# EAGLE design squawkbox_m_rj11_0.1.0 (EAGLE 7.6.0)
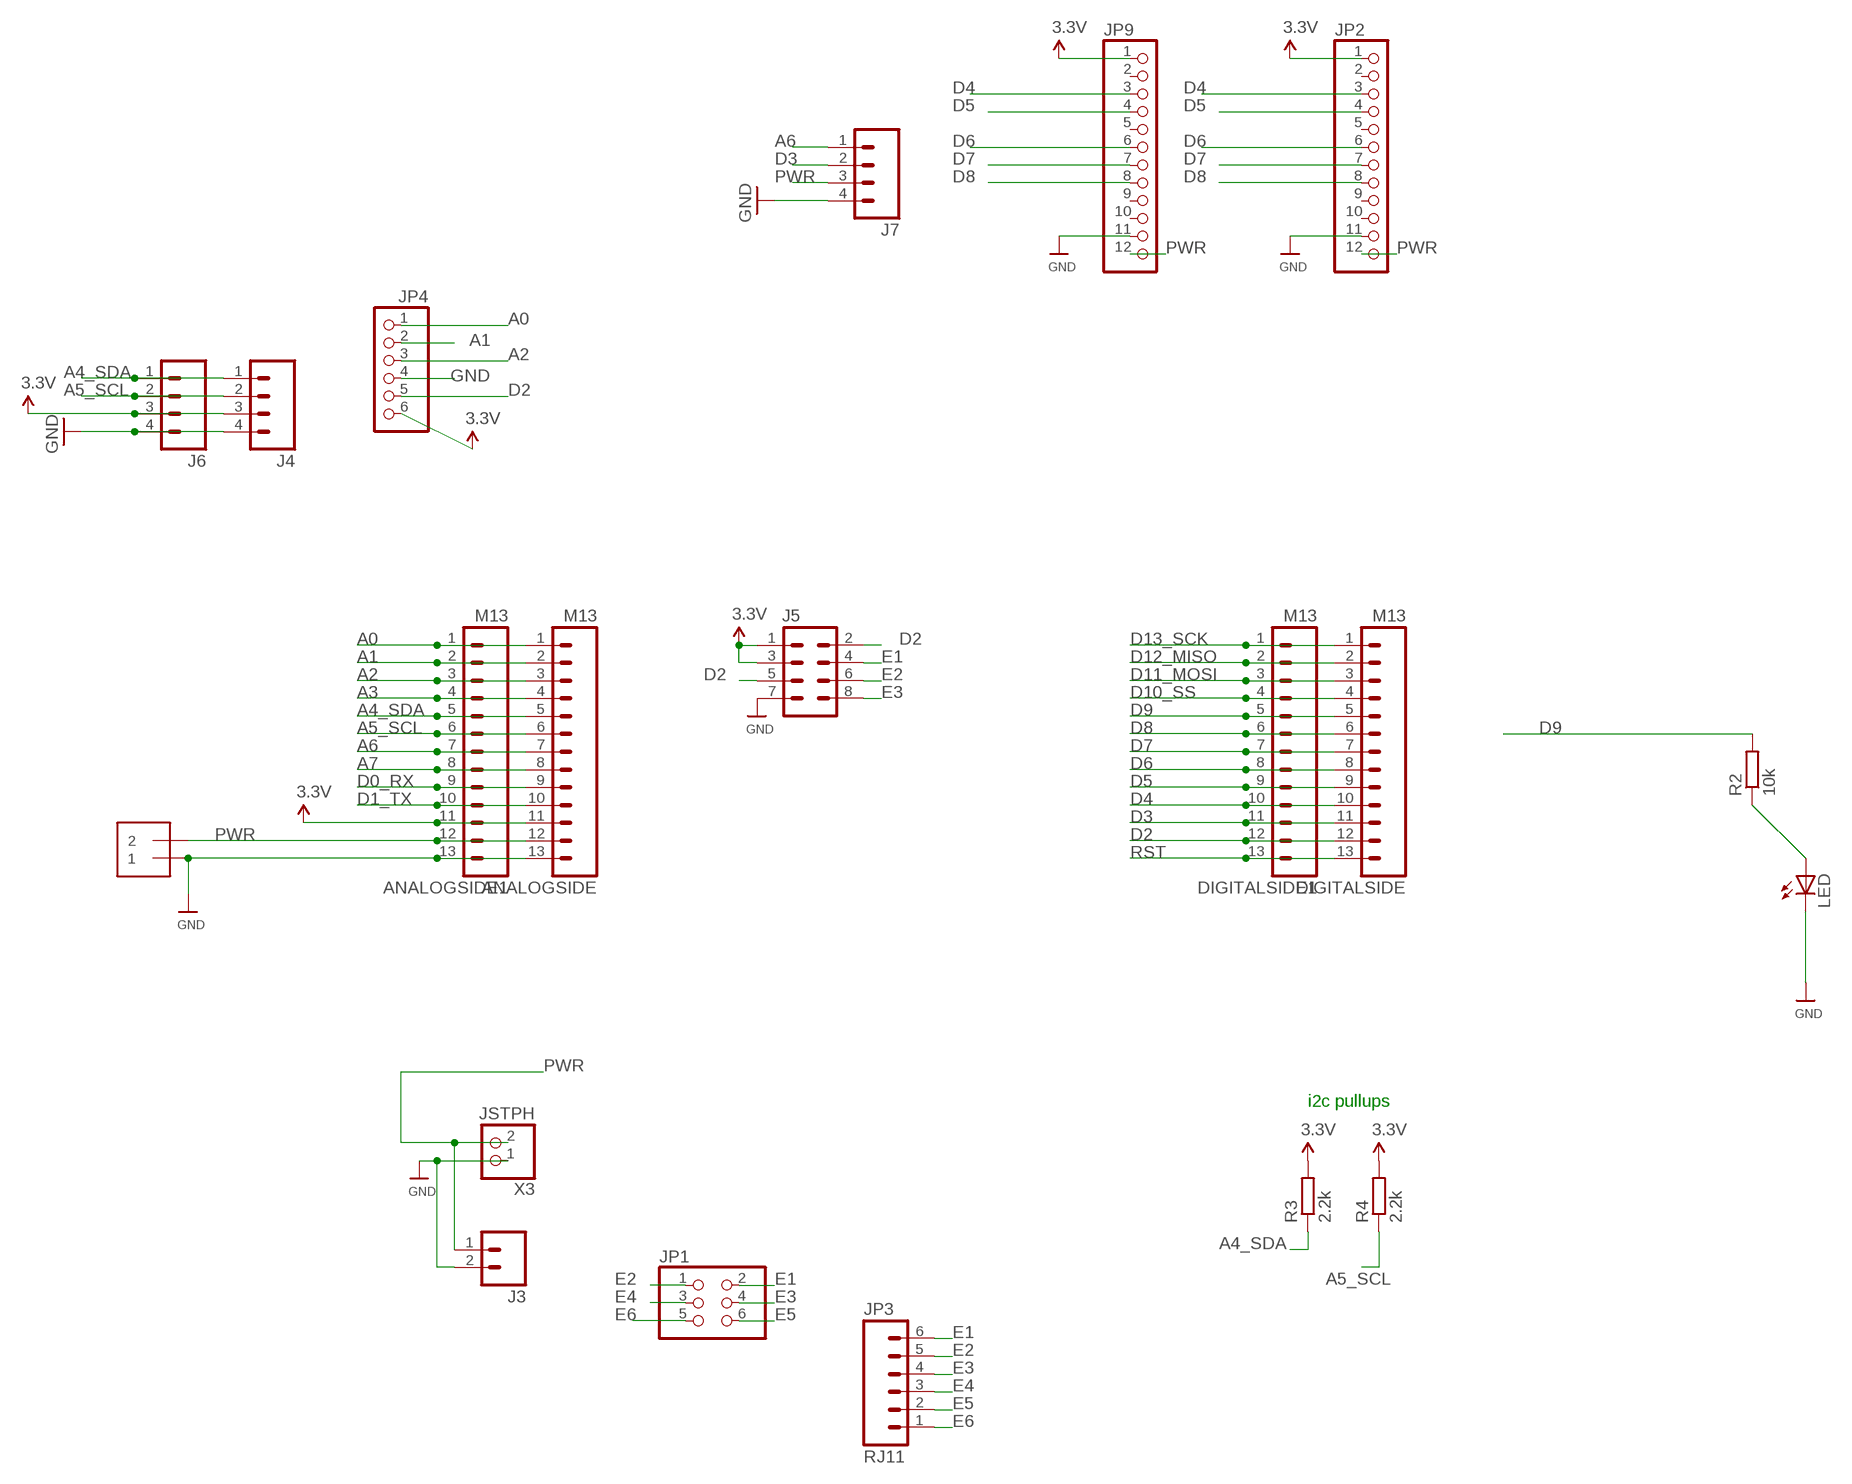
[diagram p0: schematic, sheet 1]

## Parts
ANALOGSIDE  M13  [1X13]
ANALOGSIDE1  M13  [1X13]
DIGITALSIDE  M13  [1X13]
DIGITALSIDE1  M13  [1X13]
J2  1X2-3.5MM  [1X2-3.5MM]
J3  M02PTH  [1X02]
J4  M04PTH  [1X04]
J5  M04X2  [2X4]
J6  M04SCREW  [SCREWTERMINAL-3.5MM-4]
J7  M04SCREW  [SCREWTERMINAL-3.5MM-4]
JP1  PINHD-2X3  [2X03]
JP2  PINHD-1X12-CB  [1X12-CB]
JP3  RJ11  RJ11-6PTH  [RJ11-6]
JP4  PINHD-1X6-3.5MM  [1X06-3.5MM]
JP9  PINHD-1X12-CB  [1X12-CB]
LED  LED3MM  [LED3MM]
R2  10k  R-EU_0204/7  [0204/7]
R3  2.2k  R-EU_0204/7  [0204/7]
R4  2.2k  R-EU_0204/7  [0204/7]
X3  JSTPH  CON_JST_PH_2PIN  [JSTPH2]

## Nets
A0: ANALOGSIDE1.1 ANALOGSIDE.1 JP4.1
A1: ANALOGSIDE1.2 ANALOGSIDE.2 JP4.2
A2: ANALOGSIDE1.3 ANALOGSIDE.3 JP4.3
A3: ANALOGSIDE1.4 ANALOGSIDE.4
A4_SDA: ANALOGSIDE1.5 ANALOGSIDE.5 J4.1 J6.1 R3.1
A5_SCL: ANALOGSIDE1.6 ANALOGSIDE.6 J4.2 J6.2 R4.1
A6: ANALOGSIDE1.7 ANALOGSIDE.7 J7.1
A7: ANALOGSIDE1.8 ANALOGSIDE.8
D0_RX: ANALOGSIDE1.9 ANALOGSIDE.9
D1_TX: ANALOGSIDE1.10 ANALOGSIDE.10
D2: DIGITALSIDE1.12 DIGITALSIDE.12 J5.2 J5.5 JP4.5
D3: DIGITALSIDE1.11 DIGITALSIDE.11 J7.2
D4: DIGITALSIDE1.10 DIGITALSIDE.10 JP2.3 JP9.3
D5: DIGITALSIDE1.9 DIGITALSIDE.9 JP2.4 JP9.4
D6: DIGITALSIDE1.8 DIGITALSIDE.8 JP2.6 JP9.6
D7: DIGITALSIDE1.7 DIGITALSIDE.7 JP2.7 JP9.7
D8: DIGITALSIDE1.6 DIGITALSIDE.6 JP2.8 JP9.8
D9: DIGITALSIDE1.5 DIGITALSIDE.5 R2.2
D10_SS: DIGITALSIDE1.4 DIGITALSIDE.4
D11_MOSI: DIGITALSIDE1.3 DIGITALSIDE.3
D12_MISO: DIGITALSIDE1.2 DIGITALSIDE.2
D13_SCK: DIGITALSIDE1.1 DIGITALSIDE.1
E1: J5.4 JP1.2 JP3.6
E2: J5.6 JP1.1 JP3.5
E3: J5.8 JP1.4 JP3.4
E4: JP1.3 JP3.3
E5: JP1.6 JP3.2
E6: JP1.5 JP3.1
GND [power]: ANALOGSIDE1.13 ANALOGSIDE.13 J2.1 J3.2 J4.4 J5.7 J6.4 J7.4 JP2.11 JP4.4 JP9.11 LED.K(C) X3.1
N$2: LED.A R2.1
PWR [power]: ANALOGSIDE1.12 ANALOGSIDE.12 J2.2 J3.1 J7.3 JP2.12 JP9.12 X3.2
RST: DIGITALSIDE1.13 DIGITALSIDE.13
SPEAKER2+: JP2.10
SPEAKER2+1: JP9.10
VCC [power]: ANALOGSIDE1.11 ANALOGSIDE.11 J4.3 J5.1 J5.3 J6.3 JP2.1 JP4.6 JP9.1 R3.2 R4.2 ; supply symbol labelled 3.3V
Unconnected: JP2.2 JP2.5 JP2.9 JP9.2 JP9.5 JP9.9

## Notes on the sheet
- i2c pullups

## Library data of the parts
ANALOGSIDE ANALOGSIDE1 DIGITALSIDE DIGITALSIDE1 = SparkFun-Connectors:M13: 13-pin single row .1" header
J2 = adafruit:1X2: 3.5mm Terminal block http://www.ladyada.net/library/pcb/eaglelibrary.html
J3 = SparkFun-Connectors:M02: Standard 2-pin 0.1" header. Use with - straight break away headers ( PRT-00116) - right angle break away headers (PRT-00553) - swiss pins (PRT-00743) - machine pins (PRT-00117) - female headers (PRT-00115) Molex polarized connector foot print use with: PRT-08233 with associated crimp pins and housings. 2.54_SCREWTERM for use with PRT-10571. 3.5mm Screw Terminal footprints for PRT-08084 5mm Screw Terminal footprints for use with PRT-08432
J4 = SparkFun-Connectors:M04: Header 4 Standard 4-pin 0.1" header. Use with straight break away headers (SKU : PRT-00116), right angle break away headers (PRT-00553), swiss pins (PRT-00743), machine pins (PRT-00117), and female headers (PRT-00115). Molex polarized connector foot print use with SKU : PRT-08231 with associated crimp pins and housings. 1MM SMD Version SKU: PRT-10208; PROD_ID: CONN-09696
J5 = SparkFun-Connectors:M04X2: .1" header, two rows of four.
J6 J7 = SparkFun-Connectors:M04: Header 4 Standard 4-pin 0.1" header. Use with straight break away headers (SKU : PRT-00116), right angle break away headers (PRT-00553), swiss pins (PRT-00743), machine pins (PRT-00117), and female headers (PRT-00115). Molex polarized connector foot print use with SKU : PRT-08231 with associated crimp pins and housings. 1MM SMD Version SKU: PRT-10208; PROD_ID: Combine 2x8399
JP1 = pinhead:PINHD-2X3: PIN HEADER
JP2 JP9 = adafruit2:PINHD-1X12: PIN HEADER
JP3 = SparkFun-Connectors:RJ11-6: RJ11 Jack Simple 6 pin RJ11 jack. Commonly found on CAT3 devices and Microchip programmers. SKU: PRT-00132; PROD_ID: CONN-08590
JP4 = adafruit:PINHD-1X6: PIN HEADER
LED = led:LED: LED OSRAM: - CHIPLED LG R971, LG N971, LY N971, LG Q971, LY Q971, LO R971, LY R971 LH N974, LH R974 LS Q976, LO Q976, LY Q976 LO Q996 - Hyper CHIPLED LW Q18S LB Q993, LB Q99A, LB R99A - SideLED LS A670, LO A670, LY A670, LG A670, LP A670 LB A673, LV A673, LT A673, LW A673 LH A674 LY A675 LS A676, LA A676, LO A676, LY A676, LW A676 LS A679, LY A679, LG A679 - Hyper Micro SIDELED® LS Y876, LA Y876, LO Y876, LY Y876 LT Y87S - SmartLED LW L88C, LW L88S LB L89C, LB L89S, LG L890 LS L89K, LO L89K, LY L89K LS L896, LA L896, LO L896, LY L896 - TOPLED LS T670, LO T670, LY T670, LG T670, LP T670 LSG T670, LSP T670, LSY T670, LOP T670, LYG T670 LG T671, LOG T671, LSG T671 LB T673, LV T673, LT T673, LW T673 LH T674 LS T676, LA T676, LO T676, LY T676, LB T676, LH T676, LSB T676, LW T676 LB T67C, LV T67C, LT T67C, LS T67K, LO T67K, LY T67K, LW E67C LS E67B, LA E67B, LO E67B, LY E67B, LB E67C, LV E67C, LT E67C LW T67C LS T679, LY T679, LG T679 LS T770, LO T770, LY T770, LG T770, LP T770 LB T773, LV T773, LT T773, LW T773 LH T774 LS E675, LA E675, LY E675, LS T675 LS T776, LA T776, LO T776, LY T776, LB T776 LHGB T686 LT T68C, LB T68C - Hyper Mini TOPLED® LB M676 - Mini TOPLED Santana® LG M470 LS M47K, LO M47K, LY M47K Source: http://www.osram.convergy.de LUXEON: - LUMILED® LXK2-PW12-R00, LXK2-PW12-S00, LXK2-PW14-U00, LXK2-PW14-V00 LXK2-PM12-R00, LXK2-PM12-S00, LXK2-PM14-U00 LXK2-PE12-Q00, LXK2-PE12-R00, LXK2-PE12-S00, LXK2-PE14-T00, LXK2-PE14-U00 LXK2-PB12-K00, LXK2-PB12-L00, LXK2-PB12-M00, LXK2-PB14-N00, LXK2-PB14-P00, LXK2-PB14-Q00 LXK2-PR12-L00, LXK2-PR12-M00, LXK2-PR14-Q00, LXK2-PR14-R00 LXK2-PD12-Q00, LXK2-PD12-R00, LXK2-PD12-S00 LXK2-PH12-R00, LXK2-PH12-S00 LXK2-PL12-P00, LXK2-PL12-Q00, LXK2-PL12-R00 Source: www.luxeon.com KINGBRIGHT: KA-3528ASYC Source: www.kingbright.com
R2-R4 = resistor:R-EU_: RESISTOR, European symbol
X3 = microbuilder:CON_JST_PH_2PIN: JST 2-Pin Right-Angle Connector PH-Series - 4UConnector: 17311 SH-Series - 4UConnector: 07278

## Net classes
1 power: width 0.381 mm, clearance 0.254 mm

## Board
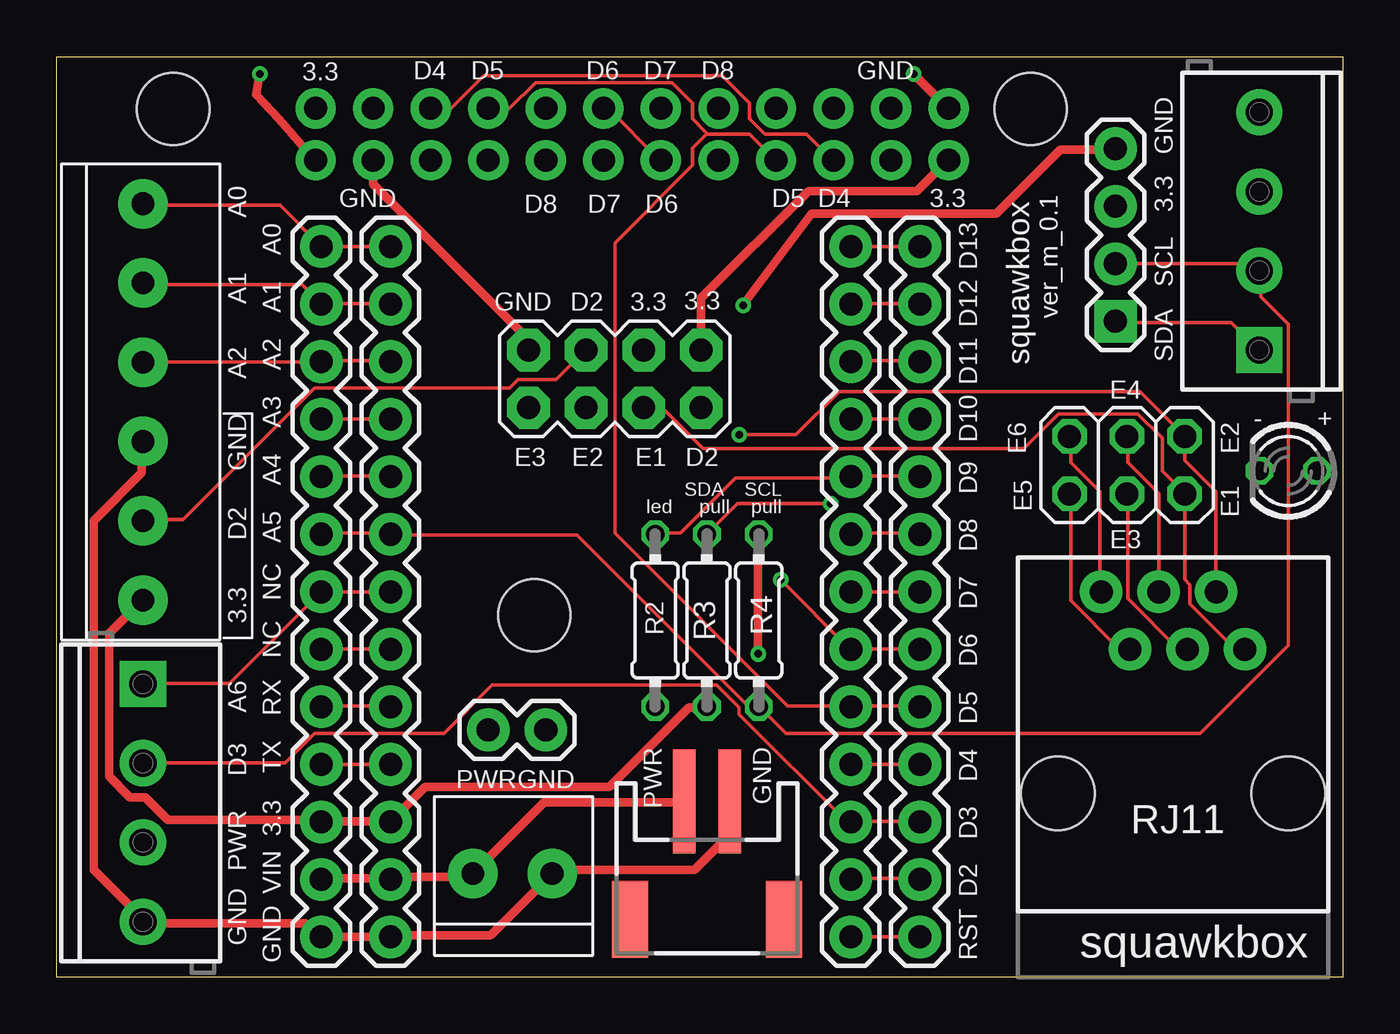
[diagram p1: board, top side]
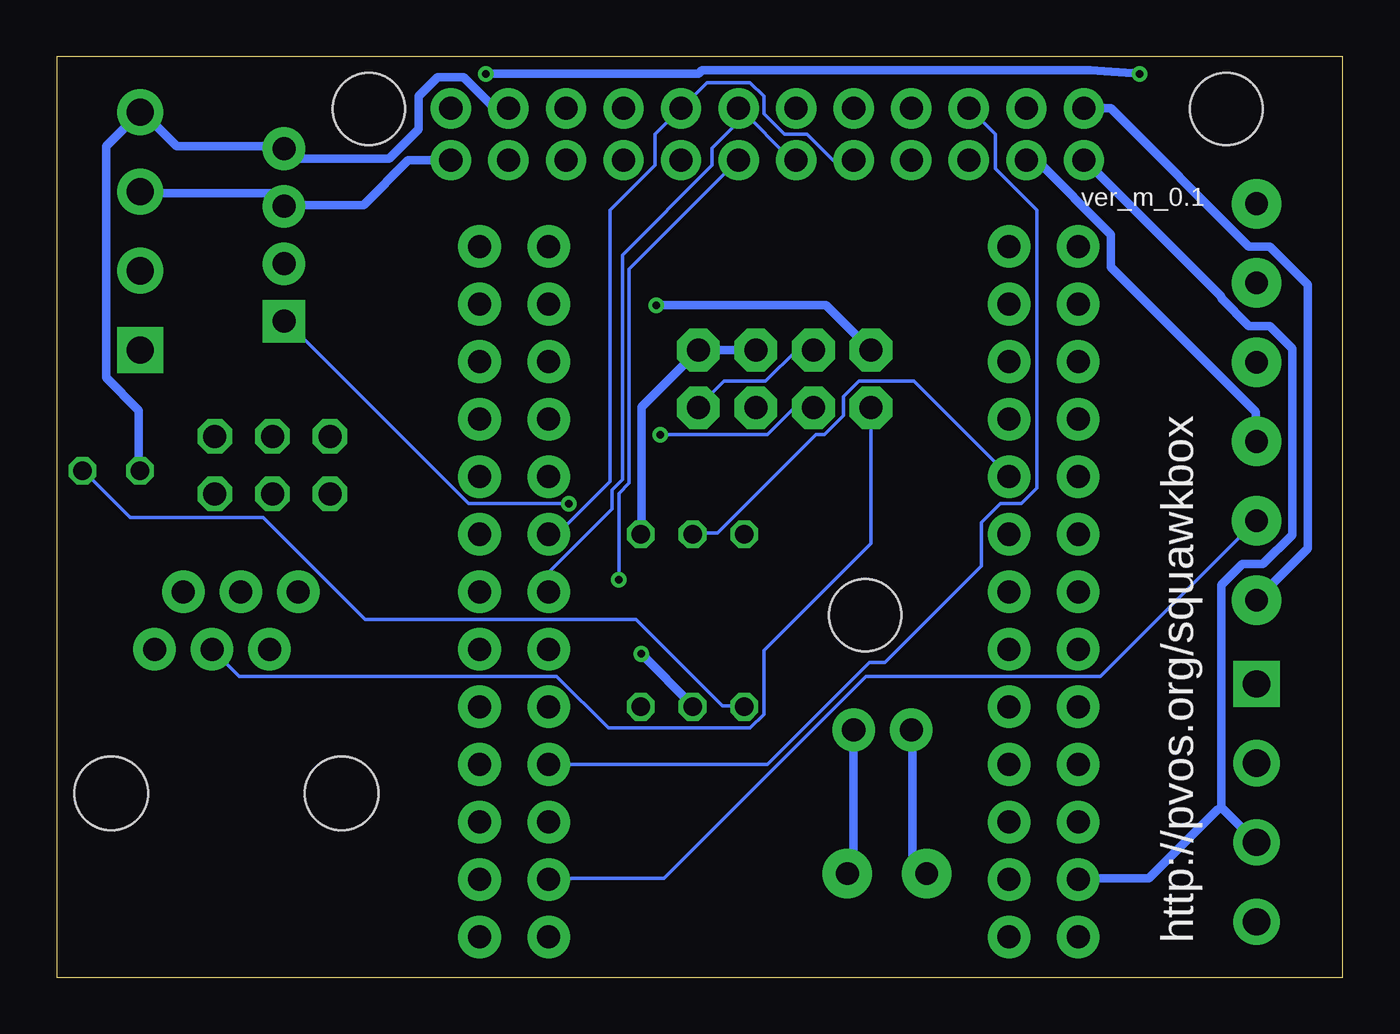
[diagram p2: board, bottom side, seen from below]

Size 56.77 x 40.64 mm. Coordinates in mm from the lower left corner, seen from the top.
Outline: 0,40.64 56.77,40.64 56.77,0 0,0 0,40.64
Copper layers (1*16): Top 0.0356mm / dielectric 1.5011mm / Bottom 0.0356mm
Design rules "oshpark-2layer": minimum track width 6mil, minimum drill 13mil, track to track 6mil, track to pad 6mil, pad to pad 6mil, via to via 6mil, smd to smd 6mil, copper to edge 15mil, drill to drill 6mil, minimum pad ring 7mil, minimum via ring 7mil, stop-mask expansion 2.5mil, vias tented up to drill 0mil, thermal gap 10mil
Holes 3.2 mm at 5.14,38.33 42.99,38.33 21.08,15.98

### Footprints (pad centres in the part's own frame; a part is rotated, then mirrored left to right if it is on the bottom)
1X13 = drill 1.016 pad 1.88: 1 0,0; 2 2.54,0; 3 5.08,0; 4 7.62,0; 5 10.16,0; 6 12.7,0; 7 15.24,0; 8 17.78,0; 9 20.32,0; 10 22.86,0; 11 25.4,0; 12 27.94,0; 13 30.48,0
1X2-3.5MM = drill 1 pad 2.184: 1 1.8,0; 2 -1.7,0
1X02 = drill 1.016 pad 1.88: 1 0,0; 2 2.54,0
1X04 = drill 1.016 pad 1.88 square: 1 0,0 | drill 1.016 pad 1.88: 2 2.54,0; 3 5.08,0; 4 7.62,0
2X4 = drill 1.016 pad 1.88 octagon: 1 -3.81,-1.27; 2 -3.81,1.27; 3 -1.27,-1.27; 4 -1.27,1.27; 5 1.27,-1.27; 6 1.27,1.27; 7 3.81,-1.27; 8 3.81,1.27
SCREWTERMINAL-3.5MM-4 = drill 1.2 pad 2.032 square: 1 0,0 | drill 1.2 pad 2.032: 2 3.5,0; 3 7,0; 4 10.5,0
2X03 = drill 1.016 octagon: 1 -2.54,-1.27; 2 -2.54,1.27; 3 0,-1.27; 4 0,1.27; 5 2.54,-1.27; 6 2.54,1.27
1X12-CB = drill 1.016 pad 1.778: 1 -13.97,0; 2 -11.43,0; 3 -8.89,0; 4 -6.35,0; 5 -3.81,0; 6 -1.27,0; 7 1.27,0; 8 3.81,0; 9 6.35,0; 10 8.89,0; 11 11.43,0; 12 13.97,0
RJ11-6 = drill 1.016 pad 1.88: 1 -3.175,8.89; 2 -1.905,6.35; 3 -0.635,8.89; 4 0.635,6.35; 5 1.905,8.89; 6 3.175,6.35 | hole 3.251: -5.08,0; 5.08,0
1X06-3.5MM = drill 1 pad 2.184: 1 -8.75,0; 2 -5.25,0; 3 -1.75,0; 4 1.75,0; 5 5.25,0; 6 8.75,0
LED3MM = drill 0.813 octagon: A -1.27,0; K 1.27,0
0204/7 = drill 0.813 octagon: 1 -3.81,0; 2 3.81,0
JSTPH2 = smd 1 x 4.6: 1 -1,-3.7; 2 1,-3.7 | smd 1.6 x 3.4: NC1 -3.4,1.5; NC2 3.4,1.5

### Placement (x,y rotation side)
ANALOGSIDE  14.73,32.26 270 top
ANALOGSIDE1  11.68,32.26 270 top
DIGITALSIDE  35.05,32.26 270 top
DIGITALSIDE1  38.1,32.26 270 top
J2  20.07,4.57 0 top
J3  19.05,10.92 0 top
J4  46.74,28.96 90 top
J5  24.64,26.42 180 top
J6  53.09,27.69 90 top
J7  3.81,12.95 270 top
JP1  47.24,22.61 180 top
JP2  25.4,36.07 180 top
JP3  49.28,8.13 0 top
JP4  3.81,25.4 270 top
JP9  25.4,38.35 0 top
LED  54.36,22.35 180 top
R2  26.42,15.75 90 top
R3  28.7,15.75 270 top
R4  30.99,15.75 90 top
X3  28.7,4.06 180 top

### Tracks (layer width: path | path; a pad name or v marks a point on that pad's centre or on a via)
A0
  Top 0.152: ANALOGSIDE.1 ANALOGSIDE1.1 9.86,34.09 3.83,34.09 JP4.1
A1
  Top 0.152: 11.68,29.74 14.73,29.74 ANALOGSIDE.2 | 11.68,29.74 10.85,30.58 3.83,30.58 JP4.2 | 11.68,29.74 ANALOGSIDE1.2
A2
  Top 0.152: ANALOGSIDE.3 14.73,27.23 11.68,27.23 ANALOGSIDE1.3 11.68,27.15 3.83,27.15 JP4.3
A3
  Top 0.152: ANALOGSIDE.4 ANALOGSIDE1.4
A4_SDA  (via drill 0.33)
  Top 0.152: J4.1 46.74,28.91 51.84,28.91 53.06,27.69 J6.1 | ANALOGSIDE1.5 11.68,22.12 14.73,22.12 ANALOGSIDE.5 | v34.16,20.9 30.05,20.9 R3.1
  Bottom 0.152: R3.1 28.68,19.61 27.61,19.61 23.27,23.95 22.89,23.95 22.05,24.79 22.05,25.63 21.36,26.31 18.92,26.31 14.73,22.12 ANALOGSIDE.5 | v34.16,20.9 38.58,20.9 46.58,28.91 46.74,28.91 J4.1
A5_SCL
  Top 0.152: J4.2 52.76,31.5 53.06,31.19 J6.2 53.14,31.12 53.14,30.05 54.36,28.83 54.36,14.66 50.47,10.77 32.18,10.77 31.04,11.91 R4.1 30.96,11.99 30.51,11.99 22.96,19.53 14.73,19.53 ANALOGSIDE.6 14.73,19.61 11.68,19.61 ANALOGSIDE1.6
A6
  Top 0.152: ANALOGSIDE.7 ANALOGSIDE1.7 7.65,12.98 3.83,12.98 J7.1
A7
  Top 0.152: ANALOGSIDE1.8 11.68,14.5 14.73,14.5 ANALOGSIDE.8
D0_RX
  Top 0.152: ANALOGSIDE1.9 11.68,11.99 14.73,11.99 ANALOGSIDE.9
D1_TX
  Top 0.152: ANALOGSIDE.10 ANALOGSIDE1.10
D2
  Top 0.152: DIGITALSIDE.12 35.08,4.37 38.05,4.37 DIGITALSIDE1.12 | JP4.5 3.83,20.22 5.59,20.22 11.38,26.01 19.99,26.01 20.37,26.39 22.05,26.39 23.34,27.69 J5.5
  Bottom 0.152: J5.5 24.11,27.69 25.48,26.31 27.3,26.31 28.45,25.17 J5.2 | DIGITALSIDE.12 35,4.37 29.97,4.37 21.06,13.28 10.69,13.28 3.83,20.14 JP4.5
D3
  Top 0.152: DIGITALSIDE1.11 38.05,6.88 35.08,6.88 DIGITALSIDE.11 35,6.88 34.85,6.88 30.12,11.61 30.12,11.91 29.13,12.9 19.23,12.9 17.09,10.77 11.38,10.77 10.08,9.47 3.83,9.47 J7.2
D4
  Top 0.152: DIGITALSIDE1.10 DIGITALSIDE.10 | JP9.3 17.4,38.35 18.85,39.8 29.36,39.8 30.58,38.58 30.58,37.9 31.27,37.21 33.1,37.21 34.24,36.07 JP2.3
  Bottom 0.152: DIGITALSIDE.10 25.4,9.4 20.9,13.89 20.22,13.89 15.95,18.16 15.95,20.07 15.11,20.9 14.2,20.9 13.51,21.59 13.51,33.86 15.34,35.69 15.34,37.21 16.48,38.35 JP9.3
D5
  Top 0.152: DIGITALSIDE1.9 38.05,11.99 35.08,11.99 DIGITALSIDE.9 35,11.99 32.26,11.99 24.64,19.61 24.64,32.41 28.07,35.84 28.07,36.6 28.71,37.25 | JP9.4 19.99,38.35 21.13,39.5 27.15,39.5 28.07,38.58 28.07,37.9 28.71,37.25 | 28.71,37.25 28.75,37.21 30.58,37.21 31.72,36.07 JP2.4
D6  (via drill 0.33)
  Top 0.152: DIGITALSIDE1.8 38.05,14.5 35.08,14.5 DIGITALSIDE.8 35,14.5 v31.95,17.55 | JP9.6 24.33,38.35 26.62,36.07 JP2.6
  Bottom 0.152: v31.95,17.55 31.95,21.36 31.5,21.82 31.5,31.27 26.7,36.07 JP2.6
D7
  Top 0.152: DIGITALSIDE1.7 DIGITALSIDE.7
  Bottom 0.152: JP2.7 24.33,36.07 26.62,38.35 JP9.7 26.39,38.05 27.84,36.6 27.84,35.84 31.8,31.88 31.8,21.97 32.26,21.51 32.26,20.68 35,17.93 35,17.02 DIGITALSIDE.7
D8
  Top 0.152: DIGITALSIDE.6 35.08,19.61 38.05,19.61 DIGITALSIDE1.6
  Bottom 0.152: JP2.8 22.5,36.07 23.65,37.21 24.64,37.21 25.55,38.12 25.55,38.89 26.16,39.5 28.07,39.5 JP9.8 30.35,37.21 30.35,35.84 32.33,33.86 32.33,21.89 34.62,19.61 35,19.61 DIGITALSIDE.6
D9
  Top 0.152: R2.2 26.47,19.61 27.53,19.61 29.97,22.05 35,22.05 DIGITALSIDE.5 35.08,22.12 38.05,22.12 DIGITALSIDE1.5
D10_SS
  Top 0.152: DIGITALSIDE1.4 DIGITALSIDE.4
D11_MOSI
  Top 0.152: DIGITALSIDE.3 35.08,27.23 38.05,27.23 DIGITALSIDE1.3
D12_MISO
  Top 0.152: DIGITALSIDE.2 35.08,29.74 38.05,29.74 DIGITALSIDE1.2
D13_SCK
  Top 0.152: DIGITALSIDE1.1 DIGITALSIDE.1
E1
  Top 0.152: JP3.6 52.45,14.5 51.99,14.5 50.01,16.48 50.01,17.32 49.78,17.55 JP1.2 49.78,21.36 48.79,22.35 48.79,23.8 47.73,24.87 44.22,24.87 42.7,23.34 28.52,23.34 26.77,25.1 25.93,25.1 J5.4
E2  (via drill 0.33)
  Top 0.152: JP3.5 51.16,17.02 51.16,21.44 49.78,22.81 JP1.1 47.8,25.86 34.54,25.86 32.64,23.95 v30.12,23.95
  Bottom 0.152: v30.12,23.95 25.4,23.95 24.26,25.1 23.42,25.1 J5.6
E3
  Top 0.152: JP1.4 47.27,21.29 47.27,16.71 49.48,14.5 49.86,14.5 JP3.4
  Bottom 0.152: J5.8 20.83,19.15 25.55,14.43 25.55,11.61 26.16,11 32.41,11 34.7,13.28 48.72,13.28 JP3.4
E4
  Top 0.152: JP3.3 48.64,21.36 47.27,22.73 47.27,23.88 JP1.3
E5
  Top 0.152: JP1.6 44.75,21.29 44.75,16.64 46.89,14.5 47.35,14.5 JP3.2
E6
  Top 0.152: JP1.5 44.75,23.88 44.75,22.73 46.05,21.44 46.05,17.02 JP3.1
GND  (via drill 0.33)
  Top 0.381: JP2.11 13.97,35 20.83,28.14 J5.7 | X3.1 29.67,7.72 29.67,6.27 28.14,4.75 22.05,4.75 21.89,4.6 J2.1 21.74,4.45 19.15,1.85 14.88,1.85 ANALOGSIDE.13 ANALOGSIDE1.13 11.53,1.85 11,2.39 3.83,2.39 J7.4 3.76,2.62 1.63,4.75 1.63,20.14 3.76,22.28 3.76,23.65 JP4.4 | v30.3,29.67 33.32,33.71 41.48,33.71 44.3,36.52 46.74,36.52 J4.4
  Bottom 0.381: JP9.11 37.44,38.35 38.81,39.73 39.95,39.73 40.79,38.89 40.79,37.44 42.09,36.14 46.35,36.14 46.74,36.52 J4.4 46.89,36.68 51.46,36.68 52.91,38.12 J6.4 53.14,38.12 54.59,36.68 54.59,26.47 53.14,25.02 53.14,22.35 LED.K | JP2.11 13.51,36.07 10.24,32.79 10.24,31.34 3.83,24.94 3.83,23.72 JP4.4 | J3.2 21.59,4.83 21.82,4.6 J2.1 | v30.3,29.67 22.81,29.67 J5.7
N$2
  Bottom 0.152: R2.1 26.47,11.99 27.38,11.99 31.19,15.8 43.15,15.8 47.65,20.3 53.52,20.3 55.57,22.35 LED.A
PWR  (via drill 0.33)
  Top 0.381: ANALOGSIDE1.12 11.68,4.37 14.73,4.37 ANALOGSIDE.12 14.88,4.45 18.24,4.45 J2.2 18.39,4.6 21.51,7.72 27.69,7.72 X3.2 | v37.82,39.88 39.34,38.35 JP9.12 | v8.97,39.88 8.81,38.96 9.83,37.87 11.38,36.07 JP2.12
  Bottom 0.381: J3.1 19,10.92 19,5.21 18.39,4.6 J2.2 | 5.36,7.49 5.36,17.32 4.45,18.24 3.53,18.24 2.23,19.53 2.23,27.76 3.23,28.75 4.14,28.75 5.36,29.97 5.36,30.05 11.38,36.07 JP2.12 | 5.36,7.49 3.83,5.97 J7.3 | v37.82,39.88 28.45,39.88 28.3,40.03 11.15,40.03 v8.97,39.88 | ANALOGSIDE1.12 11.68,4.37 8.56,4.37 5.51,7.42 5.36,7.49
RST
  Top 0.152: DIGITALSIDE1.13 DIGITALSIDE.13
VCC  (via drill 0.33)
  Top 0.381: J5.1 28.45,29.97 33.17,34.7 37.97,34.7 39.34,36.07 JP2.1 | R3.2 28.68,11.91 27.91,11.91 24.41,8.41 16.26,8.41 14.73,6.88 ANALOGSIDE.11 14.58,6.88 11.68,6.88 ANALOGSIDE1.11 11.53,6.96 4.9,6.96 3.91,7.95 3.23,7.95 2.31,8.86 2.31,15.19 3.76,16.64 JP4.6 | v30.96,14.27 30.96,19.53 R4.2
  Bottom 0.381: R4.2 30.96,19.61 30.96,25.17 J5.1 J5.3 | JP2.1 41.25,36.07 43.23,34.09 46.74,34.09 J4.3 46.89,34.16 47.35,34.62 53.06,34.62 J6.3 | JP9.1 10.24,38.35 4.14,32.26 3.23,32.26 1.55,30.58 1.55,18.92 3.76,16.71 JP4.6 | v30.96,14.27 28.68,11.99 R3.2

### Text on the board
tPlace: ver_m_0.1 | squawkbox | squawkbox
bPlace: ver_m_0.1 | http://pvos.org/squawkbox
tNames: 3.3 | D4 | D5 | D6 | D7 | D8 | GND | GND | GND | D8 | D7 | D6 | D5 | D4 | 3.3 | A0 | 3.3 | A0 | D13 | GND | D2 | 3.3 | SCL | A1 | A1 | 3.3 | D12 | SDA | A2 | A2 | D11 | E4 | A3 | - | + | E3 | E2 | E1 | D2 | D10 | E6 | E2 | GND | A4 | led | SDA | pull | SCL | pull | D9 | E5 | E1 | D2 | A5 | D8 | E3 | NC | D7 | 3.3 | R2 | NC | D6 | A6 | RX | D5 | PWR | GND | TX | PWR | GND | D3 | D4 | RJ11 | 3.3 | D3 | PWR | VIN | D2 | GND | GND | RST